# EAGLE design dummyload1 (EAGLE 6.1)
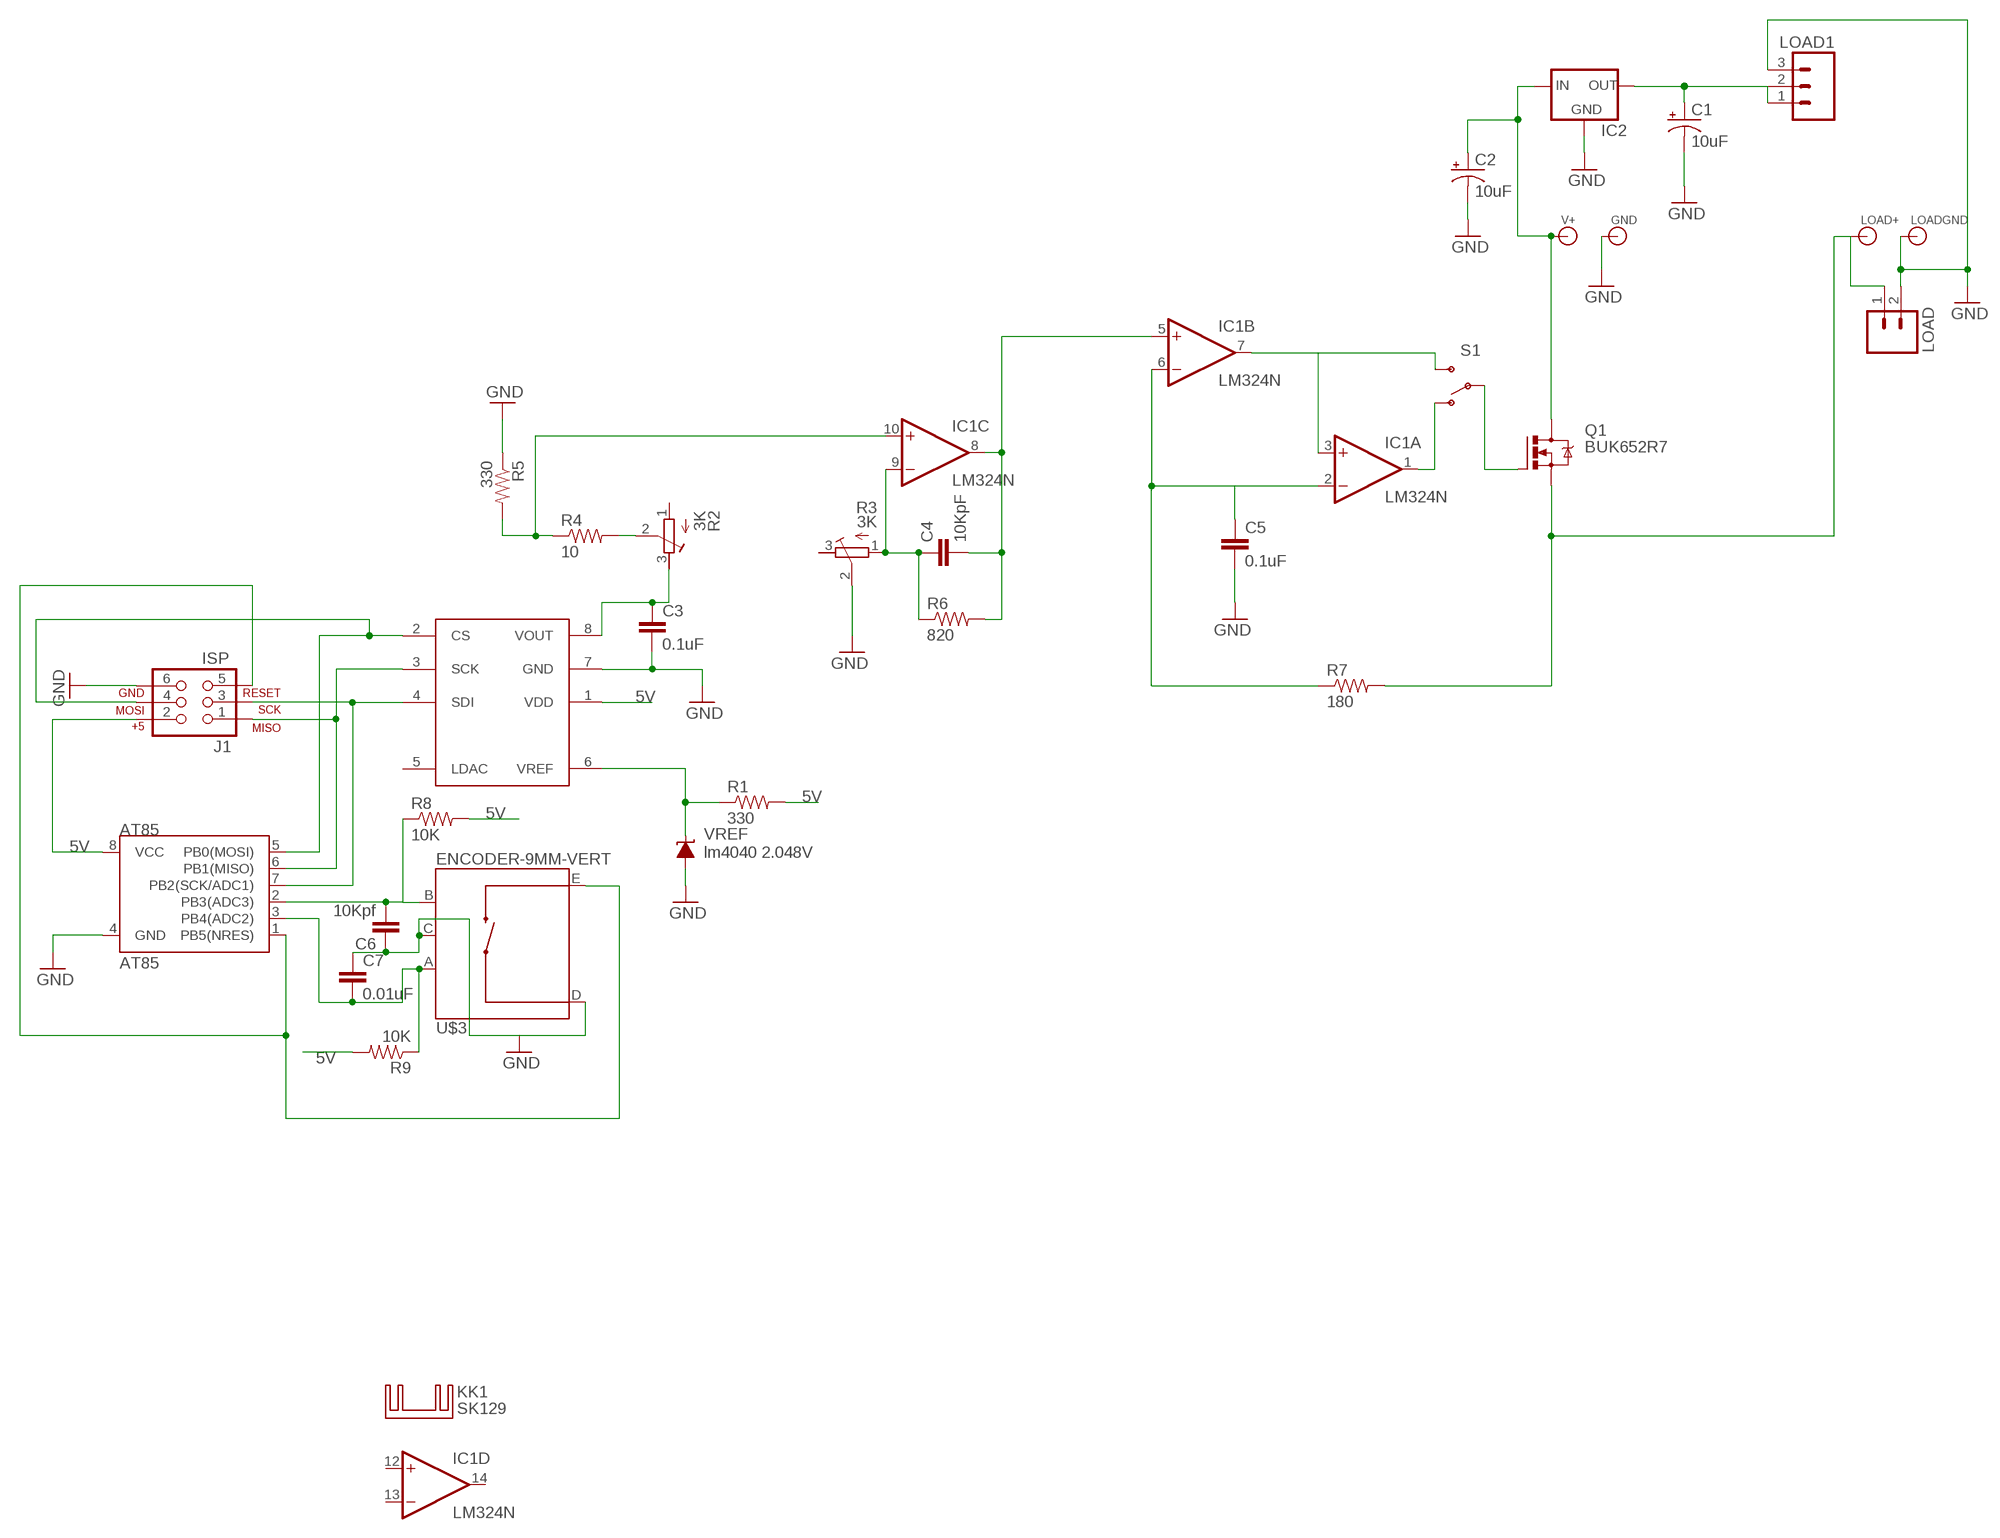
[diagram p0: schematic, sheet 1]

## Parts
AT85  AT85  ATTINY45DIP8  [DIP08]
C1  10uF  CAP_POLPTH2  [CPOL-RADIAL-10UF-25V]
C2  10uF  CAP_POLPTH2  [CPOL-RADIAL-10UF-25V]
C3  0.1uF  CAPPTH2  [CAP-PTH-SMALL2]
C4  10KpF  CAPPTH2  [CAP-PTH-SMALL2]
C5  0.1uF  CAPPTH2  [CAP-PTH-SMALL2]
C6  10Kpf  CAPPTH2  [CAP-PTH-SMALL2]
C7  0.01uF  CAPPTH2  [CAP-PTH-SMALL2]
GND  BANANA_CONN  [BANANA_CONN]
IC1  LM324N  [DIL14]
IC2  V_REG_78XXSINK  [TO220-IGO]
J1  ISP  AVR_SPI_PRG_6NS  [2X3-NS]
KK1  SK129  [SK129-HOLE]
LOAD  M02LOCK  [1X02_LOCK]
LOAD1  M031X03_NO_SILK  [1X03_NO_SILK]
LOAD+  BANANA_CONN  [BANANA_CONN]
LOADGND  BANANA_CONN  [BANANA_CONN]
Q1  BUK652R7  IRF540  [TO220BV]
R1  330  RESISTORPTH-1/4W  [AXIAL-0.4]
R2  3K  R-TRIMM3296W  [RTRIM3296W]
R3  3K  R-TRIMM3296W  [RTRIM3296W]
R4  10  RESISTORPTH-1/4W  [AXIAL-0.4]
R5  330  RESISTORPTH-1/4W  [AXIAL-0.4]
R6  820  RESISTORPTH-1/4W  [AXIAL-0.4]
R7  180  RESISTORPTH-1/4W  [AXIAL-0.4]
R8  10K  RESISTORPTH-1/4W  [AXIAL-0.4]
R9  10K  RESISTORPTH-1/4W  [AXIAL-0.4]
S1  SWITCH-SPSTPTH  [SWITCH-SPDT]
U$2  MCP4921  [DIL08]
U$3  ENCODER-9MM-VERT  [ENCODER-5PIN]
V+  BANANA_CONN  [BANANA_CONN]
VREF  lm4040 2.048V  LM4041C12LP  [LP_O-PBCY-W3]

## Nets
5V: AT85.8(VCC) C1.1(+) IC2.OUT J1.2 LOAD1.1 LOAD1.2 R1.P$2 R8.P$2 R9.P$2 U$2.1(VDD)
GND: AT85.4(GND) C1.2(-) C2.2(-) C3.2 C5.2 C6.1 C7.1 GND.P$1 IC2.GND J1.6 LOAD1.3 LOAD.2 LOADGND.P$1 R3.2(S) R5.P$1 U$2.7(GND) U$3.C U$3.D VREF.3(A)
N$1: LOAD+.P$1 LOAD.1 Q1.S R7.P$2
N$2: AT85.5(PB0(MOSI)) J1.4 U$2.2(CS)
N$3: IC1.1(A:OUT) S1.1(O)
N$5: AT85.7(PB2(SCK/ADC1)) J1.3 U$2.4(SDI)
N$6: R1.P$1 U$2.6(VREF) VREF.2(C)
N$7: C3.1 R2.3(E) U$2.8(VOUT)
N$8: R2.2(S) R4.P$2
N$9: IC1.10(C:+IN) R4.P$1 R5.P$2
N$10: C4.2 IC1.5(B:+IN) IC1.8(C:OUT) R6.P$2
N$11: C4.1 IC1.9(C:-IN) R3.1(A) R6.P$1
N$12: C5.1 IC1.2(A:-IN) IC1.6(B:-IN) R7.P$1
N$13: IC1.3(A:+IN) IC1.7(B:OUT) S1.3(S)
N$14: AT85.1(PB5(NRES)) J1.5 U$3.E
N$15: Q1.G S1.2(P)
N$16: AT85.3(PB4(ADC2)) C7.2 R9.P$1 U$3.A
N$18: AT85.2(PB3(ADC3)) C6.2 R8.P$1 U$3.B
N$19: AT85.6(PB1(MISO)) J1.1 U$2.3(SCK)
V+: C2.1(+) IC2.IN Q1.D V+.P$1
Unconnected: IC1.12(D:+IN) IC1.13(D:-IN) IC1.14(D:OUT) R2.1(A) R3.3(E) U$2.5(LDAC)

## Power pins joined to a net without a drawn wire
GND: IC1.11(P:V-)
V+: IC1.4(P:V+)

## Library data of the parts
AT85 = SparkFun:ATTINY45: Atmel ATTiny45
C1 C2 = SparkFun:CAP_POL: Capacitor Polarized These are standard SMD and PTH capacitors. Normally 10uF, 47uF, and 100uF in electrolytic and tantalum varieties. Always verify the external diameter of the through hole cap, it varies with capacity, voltage, and manufacturer. The EIA devices should be standard.
C3-C7 = SparkFun:CAP: Capacitor Standard 0603 ceramic capacitor, and 0.1" leaded capacitor.
GND LOAD+ LOADGND V+ = SparkFun:BANANA_CONN
IC1 = linear:LM324: OP AMP
IC2 = SparkFun:V_REG_78XX: Voltage Regulator Standard 7805 5V regulator. IGO (Input Ground Output). Spark Fun Electronics SKU : COM-00107
J1 = SparkFun:AVR_SPI_PRG_6: AVR ISP 6 Pin This is the reduced ISP connector for AVR programming. Common on Arduino. This footprint will take up less PCB space and can be used with a 10-pin to 6-pin adapter such as SKU: BOB-08508
KK1 = heatsink:SK129: HEATSINK manufacturer Fischer/distributor Buerklin
LOAD = SparkFun:M02: Header 2 Standard 2-pin 0.1" header. Use with straight break away headers (SKU : PRT-00116), right angle break away headers (PRT-00553), swiss pins (PRT-00743), machine pins (PRT-00117), and female headers (PRT-00115). Molex polarized connector foot print use with SKU : PRT-08233 with associated crimp pins and housings.
LOAD1 = SparkFun:M03: Header 3 Standard 3-pin 0.1" header. Use with straight break away headers (SKU : PRT-00116), right angle break away headers (PRT-00553), swiss pins (PRT-00743), machine pins (PRT-00117), and female headers (PRT-00115). Molex polarized connector foot print use with SKU : PRT-08232 with associated crimp pins and housings.
Q1 = transistor-power:IRF540: HEXFET Power MOSFET
R1 R4-R9 = SparkFun:RESISTOR: Resistor Basic schematic elements and footprints for 0603, 1206, and PTH resistors.
R2 R3 = rcl:R-TRIMM: Trimm resistor
S1 = SparkFun:SWITCH-SPST: SPST Switch Simple slide switch. Spark Fun Electronics SKU : COM-00102
U$2 = JOM:MCP4921
U$3 = JOM:ENCODER-9MM-VERT
VREF = texas:LM4041: PRECISION MICROPOWER SHUNT VOLTAGE REFERENCE Source: http://focus.ti.com/lit/ds/slcs146e/slcs146e.pdf; MPN: LM4041C12ILP; OC_FARNELL: unknown; OC_NEWARK: 18M2429

## Board
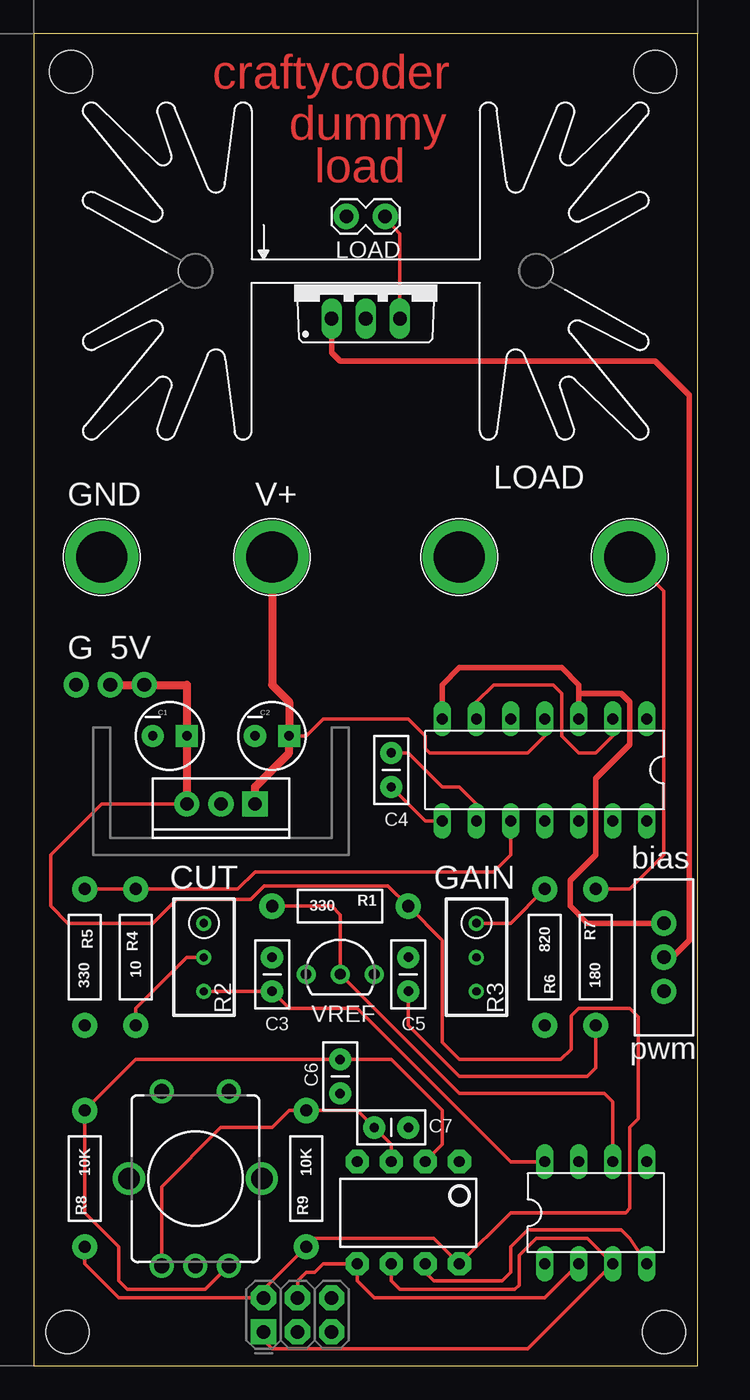
[diagram p1: board, top side]
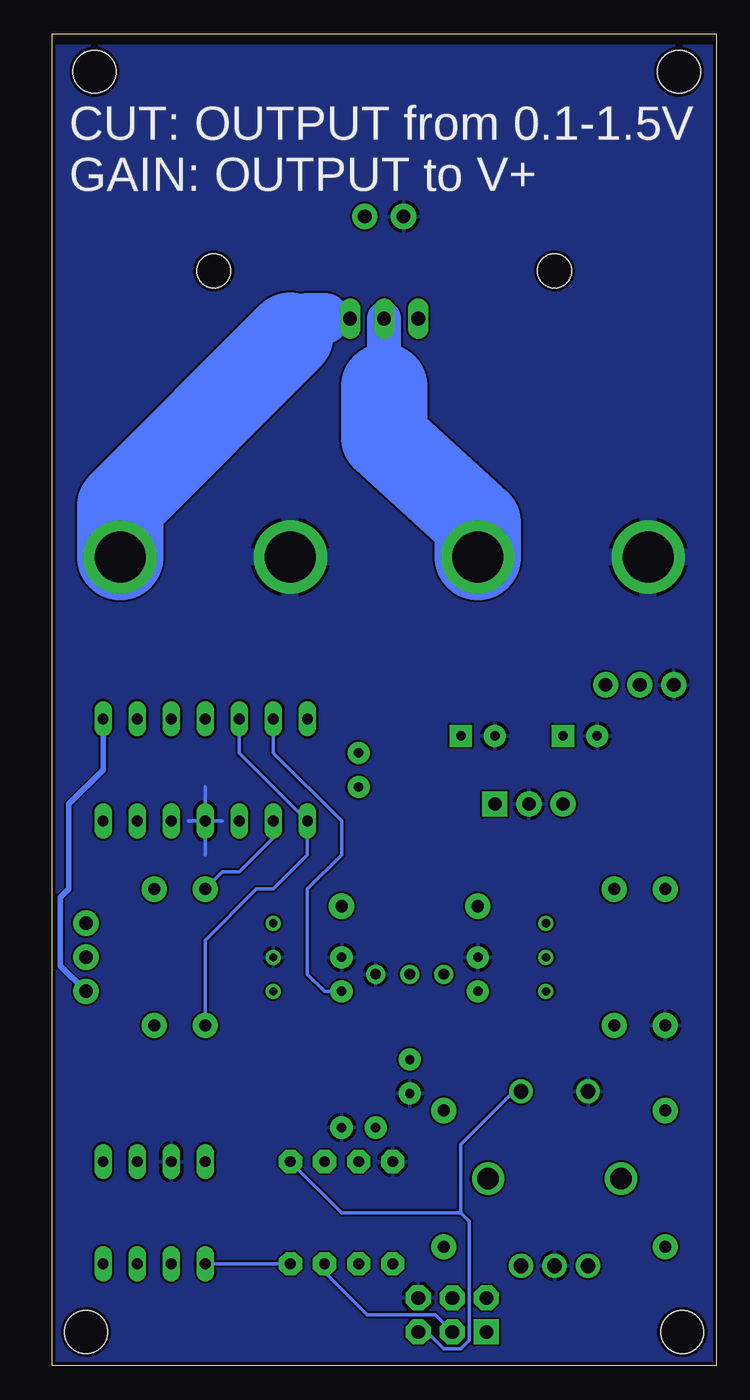
[diagram p2: board, bottom side, seen from below]

Size 49.51 x 99.36 mm. Coordinates in mm from the lower left corner, seen from the top.
Outline: 0,0 49.51,0 49.51,99.36 0,99.36 0,0
Copper layers (1*16): Top 0.035mm / dielectric 1.5mm / Bottom 0.035mm
Design rules: minimum track width 6mil, minimum drill 12mil, track to track 6mil, track to pad 6mil, pad to pad 6mil, via to via 6mil, smd to smd 0mil, copper to edge 10mil, drill to drill 10mil, minimum pad ring 10mil, minimum via ring 6mil, stop-mask expansion 2mil, vias tented up to drill 100mil, thermal gap 10mil
Holes 3.2 mm at 2.54,2.54 46.99,2.54 46.35,96.52 2.79,96.52

### Footprints (pad centres in the part's own frame; a part is rotated, then mirrored left to right if it is on the bottom)
DIP08 = drill 0.813 pad 1.727 octagon: 1 -3.81,-3.81; 2 -1.27,-3.81; 3 1.27,-3.81; 4 3.81,-3.81; 5 3.81,3.81; 6 1.27,3.81; 7 -1.27,3.81; 8 -3.81,3.81
CPOL-RADIAL-10UF-25V = drill 0.7 pad 1.651 square: 1 1.27,0 | drill 0.7 pad 1.651: 2 -1.27,0
CAP-PTH-SMALL2 = drill 0.7 pad 1.651: 1 0,0; 2 2.54,0
BANANA_CONN = drill 3.81 pad 5.461: P$1 0,0
DIL14 = drill 0.813 long: 1 -7.62,-3.81; 2 -5.08,-3.81; 3 -2.54,-3.81; 4 0,-3.81; 5 2.54,-3.81; 6 5.08,-3.81; 7 7.62,-3.81; 8 7.62,3.81; 9 5.08,3.81; 10 2.54,3.81; 11 0,3.81; 12 -2.54,3.81; 13 -5.08,3.81; 14 -7.62,3.81
TO220-IGO = drill 1 pad 1.88: GND 0,0; OUT 2.54,0 | drill 1 pad 1.88 square: IN -2.54,0
2X3-NS = drill 1.016 pad 1.88 square: 1 -2.54,-1.27 | drill 1.016 pad 1.88 octagon: 2 -2.54,1.27; 3 0,-1.27; 4 0,1.27; 5 2.54,-1.27; 6 2.54,1.27
SK129-HOLE = hole 2.54: -12.7,-0.889; 12.7,-0.889
1X02_LOCK = drill 1.016 pad 1.88: 1 -0.178,0; 2 2.718,0
1X03_NO_SILK = drill 1.016 pad 1.88: 1 0,0; 2 2.54,0; 3 5.08,0
TO220BV = drill 1.016 long: D 0,-2.54; G -2.54,-2.54; S 2.54,-2.54
AXIAL-0.4 = drill 0.9 pad 1.88: P$1 -5.08,0; P$2 5.08,0
RTRIM3296W = drill 0.61: 1 0,-2.54; 2 0,0; 3 0,2.54
SWITCH-SPDT = drill 1.016 pad 1.88: 1 0,2.54; 2 0,0; 3 0,-2.54
DIL08 = drill 0.813 long: 1 -3.81,-3.81; 2 -1.27,-3.81; 3 1.27,-3.81; 4 3.81,-3.81; 5 3.81,3.81; 6 1.27,3.81; 7 -1.27,3.81; 8 -3.81,3.81
ENCODER-5PIN = drill 1.1 pad 1.8: A -2.499,-6.502; B 2.499,-6.502; C 0,-6.502 | drill 1.1 pad 1.778: D -2.499,6.502; E 2.499,6.502 | drill 1.6: P$1 -4.95,0; P$2 4.95,0
LP_O-PBCY-W3 = drill 0.8 pad 1.4: 1 -2.54,0; 2 0,0; 3 2.54,0

### Placement (x,y rotation side)
AT85  27.94,11.43 180 top
C1  10.16,46.99 0 top
C2  17.78,46.99 0 top
C3  17.78,27.94 90 top
C4  26.67,45.72 270 top
C5  27.94,27.94 90 top
C6  22.86,20.32 90 top
C7  27.94,17.78 180 top
GND  31.75,60.33 0 top
IC1  38.1,44.45 180 top
IC2  13.97,41.91 180 top
J1  19.68,3.81 0 top
KK1  24.77,82.55 0 top
LOAD  26.04,85.72 180 top
LOAD1  8.26,50.8 180 top
LOAD+  44.45,60.33 0 top
LOADGND  5.08,60.33 0 top
Q1  24.77,80.64 0 top
R1  22.86,34.29 0 top
R2  12.7,30.48 180 top
R3  33.02,30.48 180 top
R4  7.62,30.48 270 top
R5  3.81,30.48 90 top
R6  38.1,30.48 270 top
R7  41.91,30.48 90 top
R8  3.81,13.97 270 top
R9  20.32,13.97 270 top
S1  46.99,30.48 180 top
U$1  [FREESIDELOGO-REVERSE]  19.68,65.02 0 top
U$2  41.91,11.43 0 top
U$3  12.06,13.97 0 top
V+  17.78,60.33 0 top
VREF  22.86,29.21 0 top

### Tracks (layer width: path | path; a pad name or v marks a point on that pad's centre or on a via)
5V
  Top 0.254: IC2.OUT 5.08,41.91 1.27,38.1 1.27,34.29 2.54,33.02 8.89,33.02 10.67,34.8 16.19,34.8 17.21,35.81 26.42,35.81 R1.P$2 30.48,31.75 30.48,24.13 31.75,22.86 39.31,22.86 40.07,23.62 40.07,26.1 40.64,26.67 44.45,26.67 45.09,26.04 45.09,18.41 44.45,17.78 44.45,11.75 44.13,11.43 35.56,11.43 AT85.8 29.84,9.53 20.95,9.53 R9.P$2 17.14,5.71 J1.2 6.35,5.08 3.81,7.62 R8.P$2
  Top 0.61: IC2.OUT C1.1 11.43,50.8 LOAD1.1 LOAD1.2
  Bottom 0.254: U$2.1 AT85.8
GND
  Bottom 0.254: IC1.11 38.1,43.18 | IC1.11 38.1,38.1 | IC1.11 39.37,40.64 | IC1.11 36.83,40.64
  pour Bottom: 0,0 49.53,0 49.53,98.42 0,98.42
  pour Bottom: 1.27,66.04 10.16,66.04 10.16,55.88 1.27,55.88
  pour Bottom: 27.3,65.41 36.2,65.41 36.2,55.24 27.3,55.24
  pour Bottom: 0,0 49.53,0 49.53,98.42 0,98.42
N$1
  Top 0.254: LOAD.1 26.85,84.91 27.3,84.45 Q1.S | R7.P$2 44.45,35.56 46.99,38.1 46.99,57.78 LOAD+.P$1
  Bottom 1.27: Q1.S 27.94,78.11
  Bottom 2.54: 27.94,78.11 29.21,78.11
  Bottom 3.81: 29.21,78.11 30.48,78.11 31.75,76.83
  Bottom 6.452: 31.75,76.83 44.45,64.14 LOAD+.P$1
N$2
  Top 0.254: U$2.2 38.1,5.08 25.4,5.08 24.13,6.35 AT85.5 21.59,7.62 20.95,6.99 20.32,6.99 19.68,6.35 J1.4
N$3
  Bottom 0.406: IC1.1 45.72,44.45 48.26,41.91 48.26,35.56 48.9,34.92 48.9,29.84 S1.1
N$5
  Top 0.254: AT85.7 29.21,6.99 29.84,6.35 34.92,6.35 35.56,6.99 35.56,8.89 36.83,10.16 43.81,10.16 44.45,9.53 U$2.4
  Bottom 0.254: J1.3 20.95,3.81 26.04,3.81 29.21,6.99 AT85.7
N$6
  Top 0.254: R1.P$1 22.23,34.29 22.86,33.66 VREF.2 31.75,20.32 42.55,20.32 43.18,19.68 U$2.6
N$7
  Top 0.254: R2.3 C3.1 19.05,26.67 24.13,26.67 35.56,15.24 U$2.8
N$8
  Top 0.254: R4.P$2 7.62,26.67 11.43,30.48 R2.2
N$9
  Top 0.254: R5.P$2 R4.P$1 15.24,35.56 16.51,36.83 34.29,36.83 35.56,38.1 IC1.10
N$10
  Top 0.254: IC1.8 29.21,40.64 C4.2
  Bottom 0.254: IC1.5 35.56,45.72 IC1.8 30.48,38.1 33.02,35.56 34.29,35.56 38.1,31.75 R6.P$2
N$11
  Top 0.254: C4.1 27.94,45.72 30.48,43.18 31.75,43.18 33.02,41.91 IC1.9 | R3.1 35.56,33.02 R6.P$1
  Bottom 0.254: IC1.9 33.02,39.37 35.56,36.83 36.83,36.83 R6.P$1
N$12
  Top 0.254: R7.P$1 41.91,22.23 41.27,21.59 31.75,21.59 27.94,25.4 C5.1 | IC1.6 33.02,49.53 34.29,50.8 38.73,50.8 39.37,50.16 39.37,46.99 40.64,45.72 41.91,45.72 43.18,46.99 IC1.2
  Bottom 0.254: C5.1 29.21,27.94 30.48,29.21 30.48,35.56 27.94,38.1 27.94,40.64 33.02,45.72 IC1.6
N$13
  Top 0.406: IC1.7 30.48,50.8 31.75,52.07 39.37,52.07 40.64,50.8 40.64,50.16 | 40.64,50.16 IC1.3 | S1.3 41.27,33.02 40.01,34.29 40.01,36.2 41.91,38.1 41.91,43.81 44.45,46.35 44.45,49.53 43.81,50.16 40.64,50.16
N$14
  Bottom 0.254: J1.5 21.59,2.54 20.32,1.27 19.05,1.27 18.41,1.91 18.41,10.79 19.05,11.43 | 19.05,11.43 27.94,11.43 AT85.1 | U$3.E 15.09,20.47 19.05,16.51 19.05,11.43
N$15
  Top 0.406: S1.2 47.62,30.48 48.9,31.75 48.9,72.39 46.35,74.93 22.86,74.93 22.23,75.56 Q1.G
N$16
  Top 0.254: U$3.A 9.57,13.38 13.97,17.78 17.78,17.78 19.05,19.05 R9.P$1 24.13,19.05 C7.2 26.67,16.51 AT85.3
N$18
  Top 0.254: U$3.B 12.81,5.71 6.99,5.71 6.35,6.35 6.35,8.89 3.81,11.43 R8.P$1 7.62,22.86 C6.2 26.67,22.86 30.48,19.05 30.48,16.51 AT85.2
N$19
  Top 0.254: AT85.6 26.67,6.35 27.3,5.71 35.88,5.71 36.2,6.03 36.2,8.26 37.47,9.53 41.27,9.53 U$2.3 36.83,1.27 17.78,1.27 17.14,1.91 J1.1
V+
  Top 0.254: C2.1 20.32,46.99 21.59,48.26 27.94,48.26 29.21,46.99 29.21,46.04 29.53,45.72 36.83,45.72 38.1,46.99 IC1.4
  Top 0.61: V+.P$1 17.78,50.8 19.05,49.53 C2.1 19.05,45.72 16.51,43.18 IC2.IN
  Bottom 2.54: 24.77,73.03 Q1.D
  Bottom 6.452: V+.P$1 17.78,62.87 24.77,69.22 24.77,73.03

### Text on the board
Top: craftycoder | dummy | load
tPlace: LOAD | bias | CUT | GAIN | pwm
bPlace: CUT: OUTPUT from 0.1-1.5V | GAIN: OUTPUT to V+
tNames: GND | V+ | G | 5V